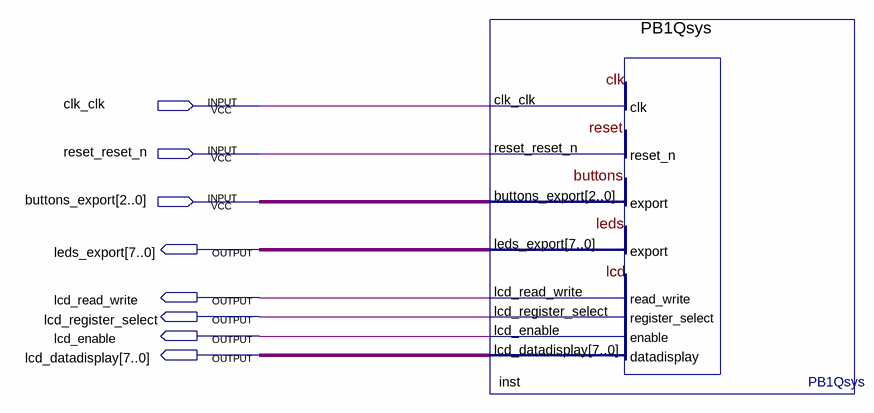
[diagram p0: schematic sheet]
// Quartus schematic PBL1.bdf as structural Verilog: 1 symbols, 8 pins
module PBL1 (
  input  clk_clk,
  input  reset_reset_n,
  input  [2:0] buttons_export,
  output [7:0] leds_export,
  output lcd_read_write,
  output lcd_register_select,
  output lcd_enable,
  output [7:0] lcd_datadisplay
);

  PB1Qsys inst (
    .clk_clk(clk_clk), .reset_reset_n(reset_reset_n), .buttons_export(buttons_export),
    .leds_export(leds_export), .lcd_read_write(lcd_read_write), .lcd_register_select(lcd_register_select),
    .lcd_enable(lcd_enable), .lcd_datadisplay(lcd_datadisplay));
endmodule
